# Altium schematic sheet [08] - IO-LINK.SchDoc
size A3; DocumentNumber: 9; SheetNumber: 9; SheetTotal: 12
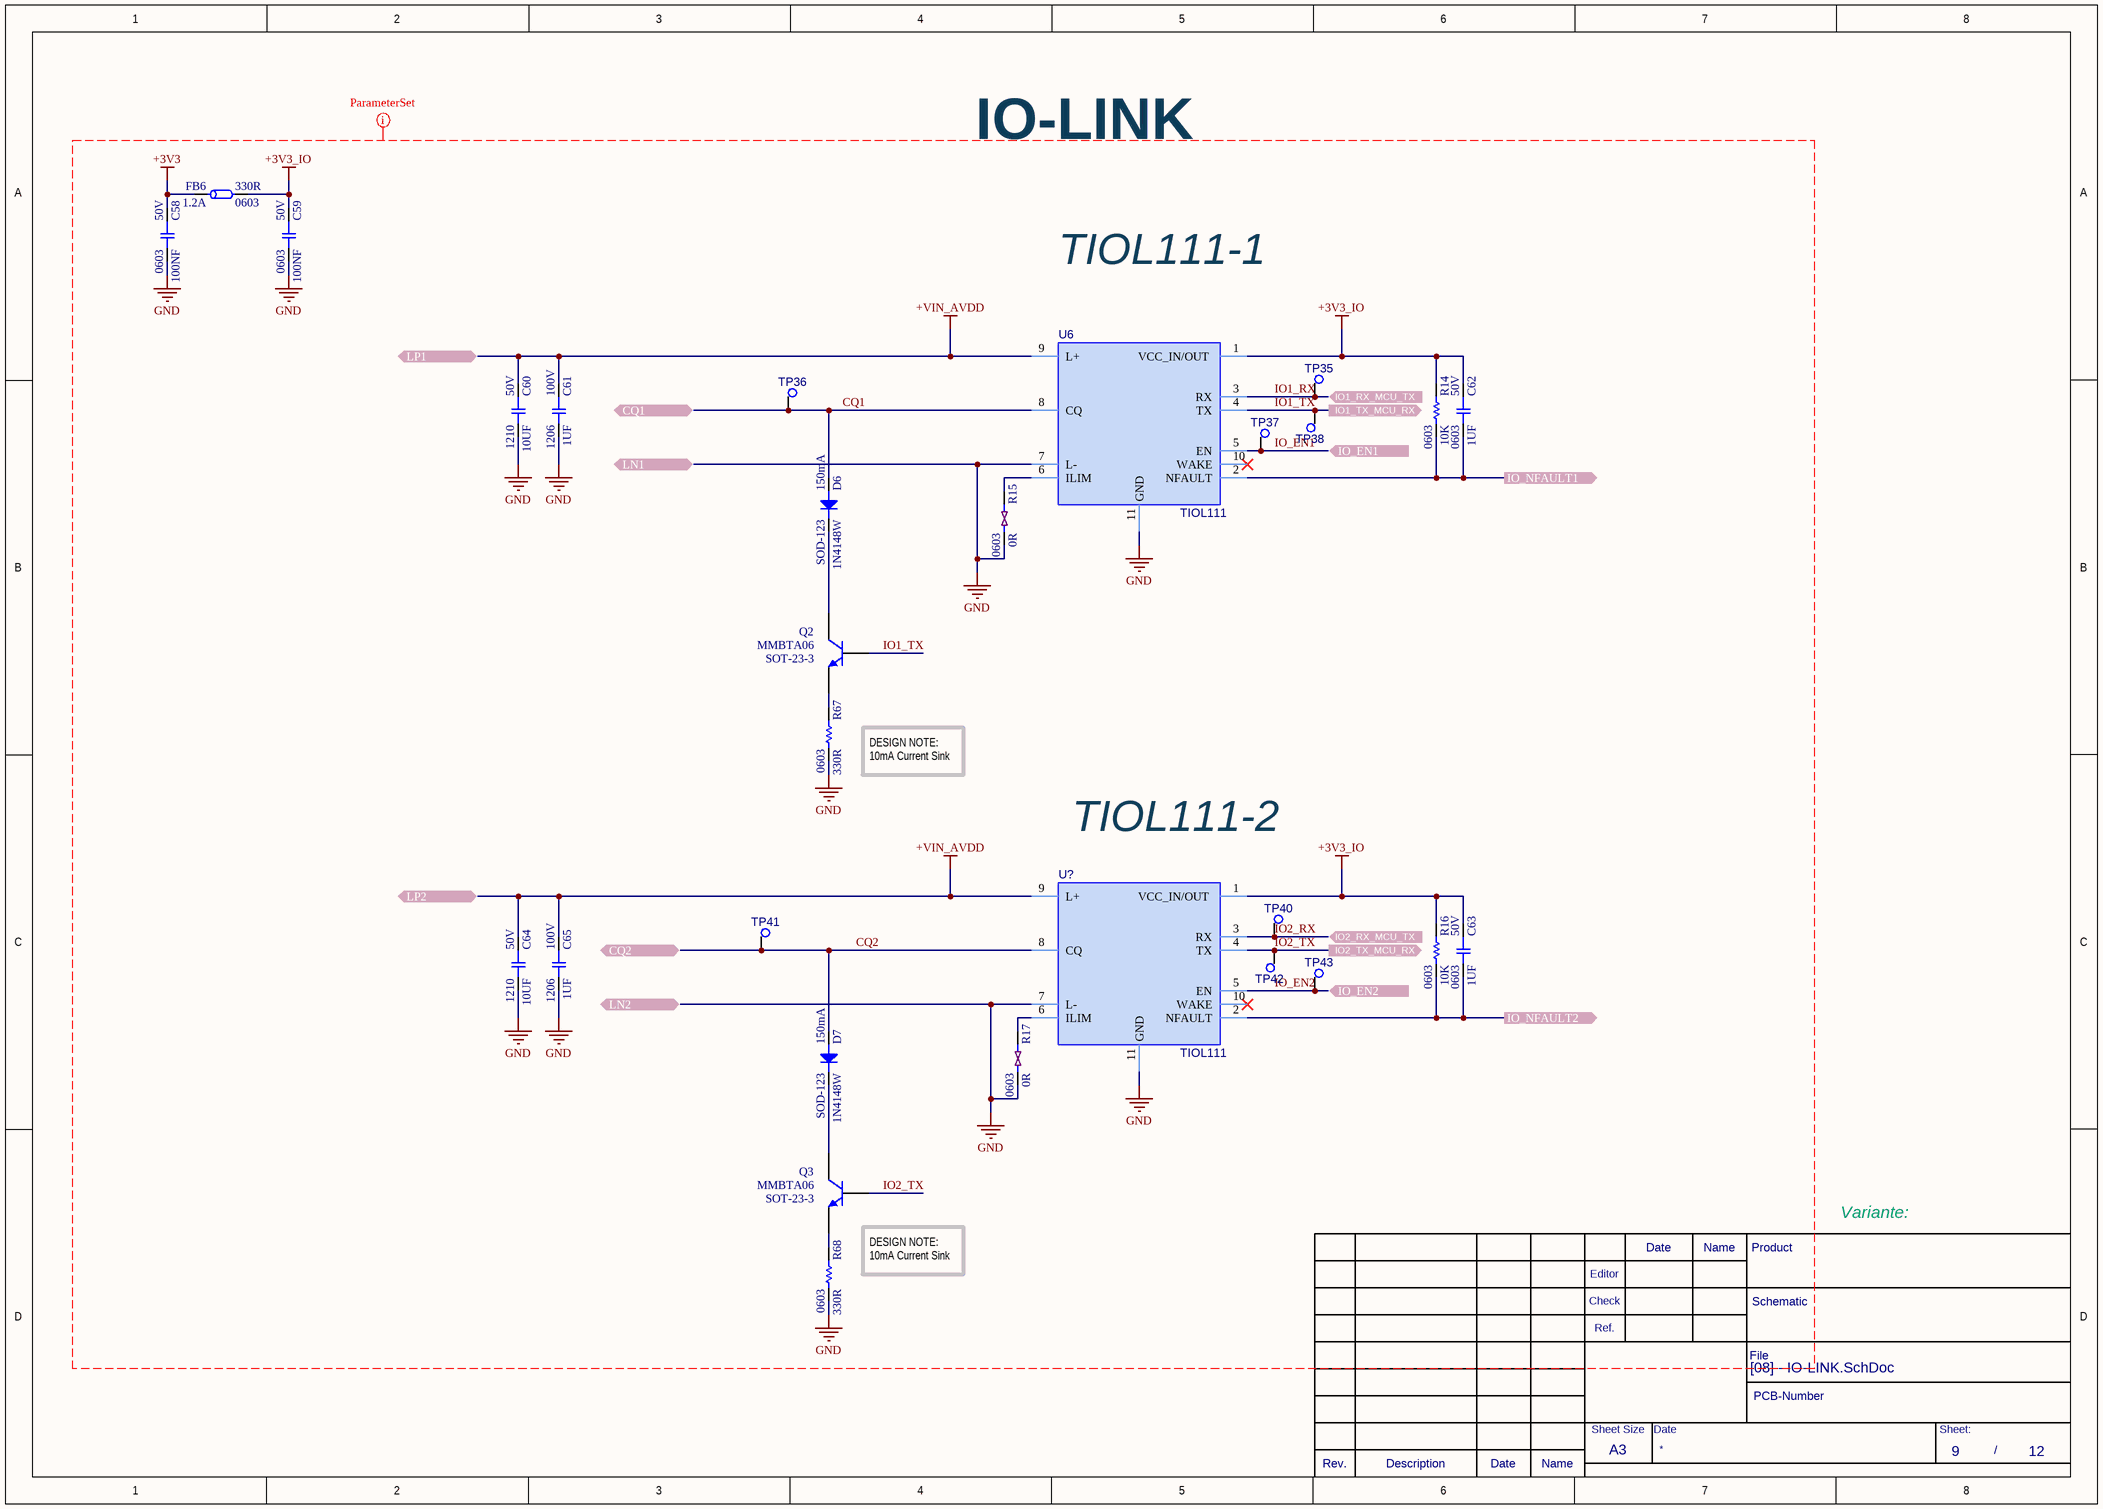
[diagram p0: [08] - IO-LINK.SchDoc]

## Parts
C58  100NF  Voltage Rating: 50V  Case Code (Imperial): 0603  [C-0603]
C59  100NF  Voltage Rating: 50V  Case Code (Imperial): 0603  [C-0603]
C60  10UF  Voltage Rating: 50V  Case/Package: 1210  [C-1210]
C61  1UF  Voltage Rating: 100V  Case Code (Imperial): 1206  [C-1206]
C62  1UF  Voltage Rating: 50V  Case Code (Imperial): 0603  [C-0603]
C63  1UF  Voltage Rating: 50V  Case Code (Imperial): 0603  [C-0603]
C64  10UF  Voltage Rating: 50V  Case/Package: 1210  [C-1210]
C65  1UF  Voltage Rating: 100V  Case Code (Imperial): 1206  [C-1206]
D6  1N4148W  Forward Current: 150mA  Package / Case: SOD-123  [D-SOD123]
D7  1N4148W  Forward Current: 150mA  Package / Case: SOD-123  [D-SOD123]
FB6  330R  Case/Package: 0603  DC Current: 1.2A  [FB-0603]
Q2  MMBTA06  Case/Package: SOT-23-3  [SOT23-3]
Q3  MMBTA06  Case/Package: SOT-23-3  [SOT23-3]
R14  10K  Case Code (Imperial): 0603  [R-0603]
R15  0R  Case Code (Imperial): 0603  [JMP-0603]
R16  10K  Case Code (Imperial): 0603  [R-0603]
R17  0R  Case Code (Imperial): 0603  [JMP-0603]
R67  330R  Case Code (Imperial): 0603  [R-0603]
R68  330R  Case Code (Imperial): 0603  [R-0603]
TP35  MECH-TESTPOINT  [MECH-TESTPOINT]  (value not drawn)  (no BOM)
TP36  MECH-TESTPOINT  [MECH-TESTPOINT]  (value not drawn)  (no BOM)
TP37  MECH-TESTPOINT  [MECH-TESTPOINT]  (value not drawn)  (no BOM)
TP38  MECH-TESTPOINT  [MECH-TESTPOINT]  (value not drawn)  (no BOM)
TP40  MECH-TESTPOINT  [MECH-TESTPOINT]  (value not drawn)  (no BOM)
TP41  MECH-TESTPOINT  [MECH-TESTPOINT]  (value not drawn)  (no BOM)
TP42  MECH-TESTPOINT  [MECH-TESTPOINT]  (value not drawn)  (no BOM)
TP43  MECH-TESTPOINT  [MECH-TESTPOINT]  (value not drawn)  (no BOM)
U6  TIOL111  [10-VSON EP]
U?  TIOL111  [10-VSON EP]

## Ports
CQ1 (bidir), CQ2 (bidir), IO1_RX_MCU_TX (in), IO1_TX_MCU_RX (out), IO2_RX_MCU_TX (in), IO2_TX_MCU_RX (out), IO_EN1 (in), IO_EN2 (in), IO_NFAULT1 (out), IO_NFAULT2 (out), LN1 (bidir), LN2 (bidir), LP1 (bidir), LP2 (bidir)

## Nets
+3V3: C58.1 FB6.1
+3V3_IO: C59.1 C62.1 C63.1 FB6.2 R14.1 R16.1 U6.1(VCC_IN/OUT) U?.1(VCC_IN/OUT)
+VIN_AVDD: C60.1 C61.1 C64.1 C65.1 U6.9(L+) U?.9(L+) ; port LP1, port LP2
GND: C58.2 C59.2 C60.2 C61.2 C64.2 C65.2 R15.2 R17.2 R67.2 R68.2 U6.7(L-) U6.11(GND) U?.7(L-) U?.11(GND) ; port LN1, port LN2
CQ1: D6.A TP36.1 U6.8(CQ) ; port CQ1
CQ2: D7.A TP41.1 U?.8(CQ) ; port CQ2
IO1_RX: TP35.1 U6.3(RX) ; port IO1_RX_MCU_TX
IO1_TX: Q2.1 TP38.1 U6.4(TX) ; port IO1_TX_MCU_RX
IO2_RX: TP40.1 U?.3(RX) ; port IO2_RX_MCU_TX
IO2_TX: Q3.1 TP42.1 U?.4(TX) ; port IO2_TX_MCU_RX
IO_EN1: TP37.1 U6.5(EN) ; port IO_EN1
IO_EN2: TP43.1 U?.5(EN) ; port IO_EN2
IO_NFAULT1: C62.2 R14.2 U6.2(NFAULT) ; port IO_NFAULT1
IO_NFAULT2: C63.2 R16.2 U?.2(NFAULT) ; port IO_NFAULT2
NetD6_C: D6.C Q2.3
NetD7_C: D7.C Q3.3
NetQ2_2: Q2.2 R67.1
NetQ3_2: Q3.2 R68.1
NetR15_1: R15.1 U6.6(ILIM)
NetR17_1: R17.1 U?.6(ILIM)

Not connected (* = marked no-connect by the designer): U6 10(WAKE)*; U? 10(WAKE)*

## Layout directives
net class IOLINK: +3V3, +3V3_IO, +VIN_AVDD, CQ1, CQ2, GND, IO1_RX, IO1_TX, IO2_RX, IO2_TX, IO_EN1, IO_EN2

## Notes on the sheet
- IO-LINK
- TIOL111-1
- (near R67) DESIGN NOTE:
  10mA Current Sink
- TIOL111-2
- DESIGN NOTE:
  10mA Current Sink
- Date
- Name
- Product
- Variante:
- Editor
- Check
- Ref.
- Schematic
- File
- PCB-Number
- Rev.
- Description
- Sheet Size
- A3
- Sheet:
- /

## Library data of the parts
C58 C59 = C-100NF-0603: CAP CER 0.1UF 50V X7R 0603; Manufacturer: TDK; Manufacturer Part Number: C1608X7R1H104K080AA; Tolerance: 10%; Dielectric Material: Ceramic; .PCBCHK: USED; .Creator: F:TALI; Washability: OK; Temperature Coefficient: 30ppm/°C; Mount: Surface Mount; Case/Package: 0603; Case Code (Metric): 1608; Min Operating Temperature: -55°C; Max Operating Temperature: 125°C; Package Quantity: 1; Packaging: Tape and Reel; Features: Soft Termination; Length: 1.6mm; Width: 0.8mm; Thickness: 0.037inch; Lead Free: Lead Free; Capacitance: 100nF; Supplier 1: Digi-Key; Supplier Part Number 1: 445-1314-1-ND; Stock 1: 0; Pricing 1: 1=0.1, 10=0.057, 100=0.0254, 500=0.01812, 1000=0.01423 (USD); Contact Plating: Matte,Tin; Voltage Rating (DC): 50V; Dielectric: X7R; Termination: SMD/SMT; Voltage: 50V; Height: 0.8mm; Depth: 0.8mm; REACH SVHC: No SVHC; ComponentLink1URL: http://www.mouser.com/ds/2/400/lcc_commercial_general_en-837201.pdf; ComponentLink1Description: http://www.mouser.com/ds/2/400/lcc_commercial_general_en-837201.pdf; ComponentLink2URL: https://product.tdk.com/info/en/catalog/spec/mlccspec_commercial_general_midvoltage_en.pdf; ComponentLink2Description: https://product.tdk.com/info/en/catalog/spec/mlccspec_commercial_general_midvoltage_en.pdf; Supplier 2: Digi-Key; Supplier Part Number 2: 478-3540-6-ND; Stock 2: 40000; Pricing 2: 1=0.23, 10=0.161, 100=0.0756, 500=0.05304, 1000=0.0439 (USD); Number of Pins: 2; Radiation Hardening: No; ComponentLink3URL: http://uk.rs-online.com/webdocs/13d1/0900766b813d1103.pdf; ComponentLink3Description: http://uk.rs-online.com/webdocs/13d1/0900766b813d1103.pdf; ComponentLink4URL: http://www.tdk.co.jp/tefe02/e412_c.pdf; ComponentLink4Description: http://www.tdk.co.jp/tefe02/e412_c.pdf; ComponentLink5URL: http://www.farnell.com/datasheets/2291921.pdf; ComponentLink5Description: http://www.farnell.com/datasheets/2291921.pdf; ComponentLink6URL: http://www.farnell.com/datasheets/1744655.pdf; ComponentLink6Description: http://www.farnell.com/datasheets/1744655.pdf; ComponentLink7URL: http://catalogs.avx.com/SurfaceMount.pdf; ComponentLink7Description: http://catalogs.avx.com/SurfaceMount.pdf; ComponentLink8URL: http://www.farnell.com/datasheets/630895.pdf; ComponentLink8Description: http://www.farnell.com/datasheets/630895.pdf; ComponentLink9URL: http://www.avx.com/docs/Catalogs/cx7r.pdf; ComponentLink9Description: http://www.avx.com/docs/Catalogs/cx7r.pdf; ComponentLink10URL: http://www.avx.com/docs/catalogs/cauto.pdf; ComponentLink10Description: http://www.avx.com/docs/catalogs/cauto.pdf; .SCHCHK: USED; Weight: 7.1E-05oz; Composition: Ceramic; ComponentLink11URL: https://www.verical.com/server-webapp/html/getDatasheet?partID=98691; ComponentLink11Description: https://www.verical.com/server-webapp/html/getDatasheet?partID=98691; ComponentLink12URL: https://www.avx.com/docs/Catalogs/flexiterm.pdf; ComponentLink12Description: https://www.avx.com/docs/Catalogs/flexiterm.pdf
C60 C64 = C-10UF-1210: CAP CER 10UF 50V X7R 1210; Manufacturer: Samsung; Manufacturer Part Number: CL32B106KBJNNNE; Material: Ceramic; Tolerance: 10%; .PCBCHK: USED; .Creator: M.OZKAN; Washability: OK; Supplier 1: Digi-Key; Supplier Part Number 1: 1276-3387-6-ND; Stock 1: 0; Pricing 1: 1=0.96, 10=0.704, 100=0.483, 500=0.38238 (USD); Mount: Surface Mount; Case Code (Metric): 3225; Case Code (Imperial): 1210; Min Operating Temperature: -55°C; Max Operating Temperature: 125°C; Packaging: Tape and Reel; Package Quantity: 1; Capacitance: 10uF; Dielectric: X7R; Voltage: 50V; Voltage Rating (DC): 50V; Length: 3.2mm; Height: 2.5mm; Width: 0.098inch; Thickness: 0.106inch; Depth: 2.5mm; Radiation Hardening: No; Lead Free: Lead Free; ComponentLink1URL: http://www.samsungsem.com/kr/support/product-search/mlcc/CL32B106KBJNNNE .jsp; ComponentLink1Description: http://www.samsungsem.com/kr/support/product-search/mlcc/CL32B106KBJNNNE .jsp; ComponentLink2URL: https://produktinfo.conrad.com/datenblaetter/450000-474999/450821-da-01-en-VS_KONDENSATOR_1210.pdf; ComponentLink2Description: https://produktinfo.conrad.com/datenblaetter/450000-474999/450821-da-01-en-VS_KONDENSATOR_1210.pdf; Supplier 2: Digi-Key; Supplier Part Number 2: 587-3167-6-ND; Stock 2: 0; Pricing 2: 1=1.02, 10=0.755, 100=0.5175 (USD); Termination: SMD/SMT; Halogen Free: Halogen Free; ComponentLink3URL: https://www.yuden.co.jp/productdata/catalog/mlcc_all_e.pdf; ComponentLink3Description: https://www.yuden.co.jp/productdata/catalog/mlcc_all_e.pdf; Supplier 3: Digi-Key; Supplier Part Number 3: 1276-3388-6-ND; Stock 3: 0; Pricing 3: 1=0.86, 10=0.61, 100=0.4017, 500=0.29756 (USD); ComponentLink4URL: http://www.samsungsem.com/kr/support/product-search/mlcc/CL32B106KBJNNWE.jsp; ComponentLink4Description: http://www.samsungsem.com/kr/support/product-search/mlcc/CL32B106KBJNNWE.jsp; .SCHCHK: USED
C61 C65 = C-1UF-1206: CAP CER 1UF 100V X7R 1206; Manufacturer: Samsung; Manufacturer Part Number: CL31B105KCHNNNE; Tolerance: 10%; .PCBCHK: CHECKED; .Creator: M.OZKAN; Washability: OK; Supplier 1: Digi-Key; Supplier Part Number 1: 1276-1838-6-ND; Stock 1: 0; Pricing 1: 1=0.36, 10=0.251, 100=0.1506, 500=0.11298, 1000=0.0954 (USD); Mount: Surface Mount; Case/Package: 1206; Case Code (Metric): 3216; Contact Plating: Tin; Min Operating Temperature: -55°C; Max Operating Temperature: 125°C; Packaging: Tape and Reel; Capacitance: 1uF; Dielectric: X7R; Length: 3.2mm; Height: 1.6mm; Width: 0.063inch; Thickness: 0.071inch; Depth: 1.6mm; Radiation Hardening: No; ComponentLink1URL: http://www.samsungsem.com/kr/support/product-search/mlcc/CL31B105KCHNNNE.jsp; ComponentLink1Description: http://www.samsungsem.com/kr/support/product-search/mlcc/CL31B105KCHNNNE.jsp; ComponentLink2URL: http://www1.futureelectronics.com/doc/SAMSUNG/CLSERIES.pdf; ComponentLink2Description: http://www1.futureelectronics.com/doc/SAMSUNG/CLSERIES.pdf; Supplier 2: Digi-Key; Supplier Part Number 2: 478-11459-6-ND; Stock 2: 142; Pricing 2: 1=1.2, 10=0.949, 100=0.7116, 500=0.53762, 1000=0.47438 (USD); Voltage Rating (DC): 100V; Package Quantity: 2000; Termination: SMD/SMT; ComponentLink3URL: http://www.mouser.com/ds/2/40/LD-Series-777051.pdf; ComponentLink3Description: http://www.mouser.com/ds/2/40/LD-Series-777051.pdf; Supplier 3: Digi-Key; Supplier Part Number 3: 445-4467-6-ND; Stock 3: 0; Pricing 3: 1=0.51, 10=0.36, 100=0.2368, 500=0.17538, 1000=0.14907 (USD); Weight: 0.000571oz; Composition: Ceramic; Voltage: 100V; REACH SVHC: No SVHC; Lead Free: Lead Free; ComponentLink4URL: http://www.mouser.com/ds/2/400/lcc_commercial_highvoltage_en-520036.pdf; ComponentLink4Description: http://www.mouser.com/ds/2/400/lcc_commercial_highvoltage_en-520036.pdf; ComponentLink5URL: http://uk.rs-online.com/webdocs/1532/0900766b81532cd0.pdf; ComponentLink5Description: http://uk.rs-online.com/webdocs/1532/0900766b81532cd0.pdf; ComponentLink6URL: http://www.farnell.com/datasheets/1484596.pdf; ComponentLink6Description: http://www.farnell.com/datasheets/1484596.pdf; ComponentLink7URL: http://product.tdk.com/en/catalog/datasheets/mlcc_commercial_midvoltage_en.pdf; ComponentLink7Description: http://product.tdk.com/en/catalog/datasheets/mlcc_commercial_midvoltage_en.pdf; .SCHCHK: CHECKED
C62 C63 = C-1UF-0603_1: CAP CER 1UF 50V X7R 0603; Manufacturer: Yageo; Manufacturer Part Number: CC0603KRX7R9BB105; Tolerance: 10%; .PCBCHK: USED; .Creator: M.OZKAN; Washability: OK; Supplier 1: Digi-Key; Supplier Part Number 1: 311-2082-1-ND; Stock 1: 0; Mount: Surface Mount; Case/Package: 0603; Weight: 7.1E-05oz; Case Code (Metric): 1608; Min Operating Temperature: -55°C; Max Operating Temperature: 125°C; Packaging: Tape and Reel; Package Quantity: 4000; Termination: SMD/SMT; Capacitance: 1uF; Voltage Rating (DC): 50V; Dielectric: X7R; Composition: Ceramic; Length: 0.063inch; Height: 0.8mm; Width: 0.031inch; Thickness: 0.035inch; Depth: 0.8mm; Radiation Hardening: No; Lead Free: Lead Free; ComponentLink1URL: https://www.yuden.co.jp/productdata/catalog/mlcc_all_e.pdf; ComponentLink1Description: https://www.yuden.co.jp/productdata/catalog/mlcc_all_e.pdf; ComponentLink2URL: http://datasheet.octopart.com/06035C105KAT2A-AVX-datasheet-13516023.pdf; ComponentLink2Description: http://datasheet.octopart.com/06035C105KAT2A-AVX-datasheet-13516023.pdf; .SCHCHK: USED; Halogen Free: Halogen Free; Supplier 2: Digi-Key; Supplier Part Number 2: 587-3247-6-ND; Stock 2: 0; Pricing 2: 1=0.29, 10=0.198, 100=0.1124, 500=0.07936, 1000=0.06943 (USD); Supplier 3: Digi-Key; Supplier Part Number 3: 478-10073-6-ND; Stock 3: 0; Pricing 3: 1=0.73, 10=0.519, 100=0.3416, 500=0.253, 1000=0.21505 (USD)
D6 D7 = D-1N4148W-SOD123: DIODE GEN PURP 100V 150MA SOD123; Manufacturer: MCC; Manufacturer Part Number: 1N4148W-TP; Max Surge Current: 2A; Forward Voltage: 1V; Recovery Time: 4ns; Max Reverse Leakage Current: 5uA; Power Dissipation: 400mW; Max Forward Surge Current (Ifsm): 1A; Element Configuration: Single; Polarity: Standard; Capacitance: 4pF; .PCBCHK: USED; .Creator: F:TALI; Washability: OK; Supplier 1: Digi-Key; Stock 1: 1558891; Pricing 1: 1=0.14, 10=0.131, 100=0.0856, 500=0.04186, 1000=0.02854 (USD); Mount: Surface Mount; Number of Pins: 2; Min Operating Temperature: -65°C; Max Operating Temperature: 150°C; Packaging: Tape and Reel; Package Quantity: 3000; Average Rectified Current: 150mA; Reverse Recovery Time: 4ns; Max Repetitive Reverse Voltage (Vrrm): 100V; Peak Non-Repetitive Surge Current: 2A; Voltage Rating (DC): 100V; Current Rating: 150mA; Output Current: 150mA; Max Reverse Voltage (DC): 100V; Length: 2.85mm; Height: 1.2mm; Width: 1.8mm; Radiation Hardening: No; REACH SVHC: Unknown; Lead Free: Lead Free; ComponentLink1URL: http://www.farnell.com/datasheets/1684829.pdf; ComponentLink1Description: http://www.farnell.com/datasheets/1684829.pdf; ComponentLink2URL: http://www.mccsemi.com/up_pdf/1N4148W(SOD123).pdf; ComponentLink2Description: http://www.mccsemi.com/up_pdf/1N4148W(SOD123).pdf; ComponentLink3URL: http://www.mouser.com/ds/2/258/1N4148W(SOD123)-349435.pdf; ComponentLink3Description: http://www.mouser.com/ds/2/258/1N4148W(SOD123)-349435.pdf; ComponentLink4URL: http://www.alliedelec.com/images/products/datasheets/bm/MCC/70055519.pdf; ComponentLink4Description: http://www.alliedelec.com/images/products/datasheets/bm/MCC/70055519.pdf; Supplier Part Number 1: 1N4148WTPMSDKR-ND; Parameter 2: *; .SCHCHK: USED
FB6 = FB-330R-0603: FERRITE BEAD 330 OHM 0603 1LN; Manufacturer: Murata; Manufacturer Part Number: BLM18PG331SN1D; Material: Steel,Ferrite; Tolerance: 25%; DC Resistance (DCR): 150mR; Number of Lines: 1; Test Frequency: 100MHz; Shielding: Unshielded; Washability: OK; .Creator: M.OZKAN; .PCBCHK: USED; Supplier 1: Digi-Key; RoHS: Yes; Number of Pins: 2; Core Material: Ferrite; Case Code (Metric): 1608; Case Code (Imperial): 0603; Min Operating Temperature: -55°C; Max Operating Temperature: 125°C; Impedance: 330R; Package Quantity: 1; Packaging: Tape and Reel; Current Rating: 1.2A; Max Current Rating: 1.2A; Termination: SMD/SMT; Number of Circuits: 1; Length: 1.75mm; Height: 0.8mm; Width: 0.8mm; Depth: 0.95mm; Radiation Hardening: No; REACH SVHC: No SVHC; Lead Free: Lead Free; ComponentLink1URL: https://datasheet.ciiva.com/6211/enfa0003-6211710.pdf?src-supplier=Digi-Key; ComponentLink1Description: https://datasheet.ciiva.com/6211/enfa0003-6211710.pdf?src-supplier=Digi-Key; Supplier Part Number 1: 490-5222-1-ND; Max DC Current: 1.2A; .SCHCHK: USED; Stock: 106218; Pricing: 1=0.1, 10=0.076, 25=0.0684, 50=0.05, 100=0.0433, 250=0.0342, 500=0.0288, 1000=0.0243 (USD)
Q2 Q3 = Q-MMBTA06: TRANS NPN 80V 0.5A SOT23; Manufacturer: ON Semiconductor; Manufacturer Part Number: MMBTA06LT1G; .Creator: F:TALI; .PCBCHK: USED; Max Power Dissipation: 225mW; Number of Elements: 1; Frequency: 100MHz; Emitter Base Voltage (VEBO): 4V; Collector Emitter Saturation Voltage: 250mV; Max Collector Current: 500mA; Power Dissipation: 300mW; Element Configuration: Single; hFE Min: 100; ComponentLink1URL: http://www.fairchildsemi.com/ds/MM/MMBTA06.pdf; ComponentLink1Description: http://www.fairchildsemi.com/ds/MM/MMBTA06.pdf; ComponentLink2URL: http://www.farnell.com/datasheets/48137.pdf; ComponentLink2Description: http://www.farnell.com/datasheets/48137.pdf; ComponentLink3URL: http://www.farnell.com/datasheets/1852077.pdf; ComponentLink3Description: http://www.farnell.com/datasheets/1852077.pdf; ComponentLink4URL: http://www.fairchildsemi.com/datasheets/MP/MPSA06.pdf; ComponentLink4Description: http://www.fairchildsemi.com/datasheets/MP/MPSA06.pdf; ComponentLink5URL: http://www.mouser.com/ds/2/149/MMBTA06-196120.pdf; ComponentLink5Description: http://www.mouser.com/ds/2/149/MMBTA06-196120.pdf; ComponentLink6URL: https://www.verical.com/server-webapp/html/getDatasheet?partID=130058; ComponentLink6Description: https://www.verical.com/server-webapp/html/getDatasheet?partID=130058; .SCHCHK: USED; Supplier 1: Digi-Key; Supplier Part Number 1: MMBTA06LT1GOSCT-ND; Stock: 165416; Pricing: 1=0.16, 10=0.15, 25=0.1424, 100=0.0627, 250=0.0602, 500=0.0492, 1000=0.0342 (USD); RoHS: Yes; Number of Pins: 3; Contact Plating: Tin,Matte; Min Operating Temperature: -55°C; Max Operating Temperature: 150°C; Package Quantity: 1; Collector Emitter Voltage (VCEO): 80V; Packaging: Tape and Reel; Polarity: NPN; Collector Base Voltage (VCBO): 80V; Collector Emitter Breakdown Voltage: 80V; Transition Frequency: 100MHz; Max Breakdown Voltage: 80V; Max Frequency: 100MHz; Gain Bandwidth Product: 100MHz; Voltage Rating (DC): 80V; Current Rating: 500mA; Length: 0.119inch; Height: 0.04inch; Width: 0.055inch; Radiation Hardening: No; REACH SVHC: No SVHC; Lead Free: Lead Free; ComponentLink7URL: https://datasheet.ciiva.com/4722/mmbta05lt1-d-101659-4722113.pdf?src-supplier=Mouser; ComponentLink7Description: https://datasheet.ciiva.com/4722/mmbta05lt1-d-101659-4722113.pdf?src-supplier=Mouser; ComponentLink8URL: https://datasheet.ciiva.com/15139/getdatasheetpartid-137838-15139444.pdf?src-supplier=Verical; ComponentLink8Description: https://datasheet.ciiva.com/15139/getdatasheetpartid-137838-15139444.pdf?src-supplier=Verical; ComponentLink9URL: https://datasheet.ciiva.com/16465/mmbta05lt1-d-16465685.pdf?src-supplier=Future+Electronics; ComponentLink9Description: https://datasheet.ciiva.com/16465/mmbta05lt1-d-16465685.pdf?src-supplier=Future+Electronics; ComponentLink10URL: https://datasheet.ciiva.com/11197/mmbta05lt1-d-11197414.pdf?src-supplier=Avnet; ComponentLink10Description: https://datasheet.ciiva.com/11197/mmbta05lt1-d-11197414.pdf?src-supplier=Avnet; ComponentLink11URL: https://datasheet.ciiva.com/11198/mmbta05lt1-d-11198678.pdf?src-supplier=Avnet; ComponentLink11Description: https://datasheet.ciiva.com/11198/mmbta05lt1-d-11198678.pdf?src-supplier=Avnet; ComponentLink12URL: https://datasheet.ciiva.com/976/mmbta05lt1-d-976473.pdf?src-supplier=Digi-Key; ComponentLink12Description: https://datasheet.ciiva.com/976/mmbta05lt1-d-976473.pdf?src-supplier=Digi-Key; ComponentLink13URL: https://datasheet.ciiva.com/976/mmbta05lt1-d-976474.pdf?src-supplier=Digi-Key; ComponentLink13Description: https://datasheet.ciiva.com/976/mmbta05lt1-d-976474.pdf?src-supplier=Digi-Key; ComponentLink14URL: https://datasheet.ciiva.com/976/mmbta05lt1-d-976475.pdf?src-supplier=Digi-Key; ComponentLink14Description: https://datasheet.ciiva.com/976/mmbta05lt1-d-976475.pdf?src-supplier=Digi-Key; ComponentLink15URL: https://datasheet.ciiva.com/7972/mmbta05lt1-d-7972078.pdf?src-supplier=Element14; ComponentLink15Description: https://datasheet.ciiva.com/7972/mmbta05lt1-d-7972078.pdf?src-supplier=Element14; ComponentLink16URL: https://datasheet.ciiva.com/16478/mmbta05lt1-d-16478574.pdf?src-supplier=Avnet+Asia; ComponentLink16Description: https://datasheet.ciiva.com/16478/mmbta05lt1-d-16478574.pdf?src-supplier=Avnet+Asia; ComponentLink17URL: https://datasheet.ciiva.com/25998/mmbta05lt1-d-25998830.pdf?src-supplier=Avnet+Europe; ComponentLink17Description: https://datasheet.ciiva.com/25998/mmbta05lt1-d-25998830.pdf?src-supplier=Avnet+Europe
R14 R16 = R-10K-0603: RES SMD 10K OHM 1% 1/10W 0603; Manufacturer: Yageo; Manufacturer Part Number: RC0603FR-0710KL; Resistance: 10kR; Temperature Coefficient: 100ppm/°C; Voltage Rating (DC): 50V; Power Rating: 100mW; Voltage Rating: 75V; .PCBCHK: USED; .Creator: F:TALI; Washability: OK; Supplier 1: Digi-Key; Supplier Part Number 1: 311-10.0KHRCT-ND; Stock 1: 37479107; Pricing 1: 1=0.1, 10=0.026, 100=0.0107, 1000=0.00478, 2500=0.00415 (USD); Case/Package: 0603; Number of Pins: 2; Weight: 7.1E-05oz; Case Code (Metric): 1608; Min Operating Temperature: -55°C; Max Operating Temperature: 155°C; Tolerance: 1%; Composition: Thick Film; Packaging: Tape and Reel; Military Standard: Not; Termination: SMD/SMT; Length: 1.6mm; Height: 0.45mm; Width: 0.8mm; Depth: 0.8mm; Lead Pitch: 0.3mm; REACH SVHC: No SVHC; Lead Free: Lead Free; ComponentLink1URL: http://www.farnell.com/datasheets/38590.pdf; ComponentLink1Description: http://www.farnell.com/datasheets/38590.pdf; ComponentLink2URL: https://www.verical.com/server-webapp/html/getDatasheet?partID=409289; ComponentLink2Description: https://www.verical.com/server-webapp/html/getDatasheet?partID=409289; ComponentLink3URL: http://www.farnell.com/datasheets/1868787.pdf; ComponentLink3Description: http://www.farnell.com/datasheets/1868787.pdf; ComponentLink4URL: http://www.farnell.com/datasheets/443971.pdf; ComponentLink4Description: http://www.farnell.com/datasheets/443971.pdf; ComponentLink5URL: http://www.farnell.com/datasheets/1738695.pdf; ComponentLink5Description: http://www.farnell.com/datasheets/1738695.pdf; Supplier 2: Digi-Key; Supplier Part Number 2: 311-10KGRDKR-ND; Stock 2: 34952003; Pricing 2: 1=0.1, 10=0.022, 100=0.0088, 1000=0.00396, 2500=0.00344 (USD); Contact Plating: Matte,Tin; Radiation Hardening: No; ComponentLink6URL: http://www.yageo.com/documents/recent/PYu-RC_Group_51_RoHS_L_9.pdf; ComponentLink6Description: http://www.yageo.com/documents/recent/PYu-RC_Group_51_RoHS_L_9.pdf; ComponentLink7URL: https://www.verical.com/server-webapp/html/getDatasheet?partID=327958; ComponentLink7Description: https://www.verical.com/server-webapp/html/getDatasheet?partID=327958; ComponentLink8URL: http://www.yageo.com/documents/recent/PYu-RC_Group_51_RoHS_L_2.pdf; ComponentLink8Description: http://www.yageo.com/documents/recent/PYu-RC_Group_51_RoHS_L_2.pdf; Mount: Surface Mount; Package Quantity: 1; Number of Terminations: 2; Max Power Dissipation: 100mW; Working Voltage: 75V; Features: Automotive AEC-Q200; ComponentLink9URL: http://www.farnell.com/datasheets/1678796.pdf; ComponentLink9Description: http://www.farnell.com/datasheets/1678796.pdf; ComponentLink10URL: http://industrial.panasonic.com/www-cgi/jvcr13pz.cgi?E+PZ+3+AOA0002+ERJ1GNJ120C+7+WW; ComponentLink10Description: http://industrial.panasonic.com/www-cgi/jvcr13pz.cgi?E+PZ+3+AOA0002+ERJ1GNJ120C+7+WW; ComponentLink11URL: http://industrial.panasonic.com/www-data/pdf/AOA0000/AOA0000CE1.pdf; ComponentLink11Description: http://industrial.panasonic.com/www-data/pdf/AOA0000/AOA0000CE1.pdf; ComponentLink12URL: http://www.jameco.com/Jameco/Products/ProdDS/2007265.pdf; ComponentLink12Description: http://www.jameco.com/Jameco/Products/ProdDS/2007265.pdf; ComponentLink13URL: https://industrial.panasonic.com/cdbs/www-data/pdf/RDA0000/AOA0000C301.pdf; ComponentLink13Description: https://industrial.panasonic.com/cdbs/www-data/pdf/RDA0000/AOA0000C301.pdf; Supplier 3: Digi-Key; Supplier Part Number 3: YAG1290DKR-ND; Stock 3: 0; Pricing 3: 1=0.1, 10=0.044, 100=0.0178, 1000=0.00798, 2500=0.00693 (USD); .SCHCHK: USED
R15 R17 = R-0R-0603: RES SMD 0 OHM 1/10W JUMP 0603; Manufacturer: Yageo; Manufacturer Part Number: RC0603JR-070RL; Resistance: 0mR; Tolerance: 1%; Power Rating: 100mW; Voltage Rating (DC): 50V; Temperature Coefficient: 200ppm/°C; Current Rating: 1A; Working Voltage: 75V; .PCBCHK: USED; .Creator: F:TALI; Washability: OK; Supplier 1: Digi-Key; Supplier Part Number 1: 311-0.0GRDKR-ND; Stock 1: 54397731; Pricing 1: 1=0.1, 10=0.021, 25=0.0152, 50=0.0114, 100=0.0084, 250=0.00644, 500=0.00514, 1000=0.00379 (USD); Case/Package: 0603; Number of Pins: 2; Contact Plating: Matte,Tin; Case Code (Metric): 1608; Min Operating Temperature: -55°C; Max Operating Temperature: 155°C; Composition: Thick Film; Packaging: Tape and Reel; Termination: SMD/SMT; Package Quantity: 5000; Voltage Rating: 50V; Military Standard: Not; Length: 1.6mm; Height: 0.45mm; Width: 0.8mm; Depth: 0.8mm; Radiation Hardening: No; REACH SVHC: No SVHC; Lead Free: Lead Free; ComponentLink1URL: http://www.farnell.com/datasheets/1738695.pdf; ComponentLink1Description: http://www.farnell.com/datasheets/1738695.pdf; ComponentLink2URL: https://www.verical.com/server-webapp/html/getDatasheet?partID=329462; ComponentLink2Description: https://www.verical.com/server-webapp/html/getDatasheet?partID=329462; ComponentLink3URL: http://www.yageo.com/documents/recent/PYu-RC_Group_51_RoHS_L_9.pdf; ComponentLink3Description: http://www.yageo.com/documents/recent/PYu-RC_Group_51_RoHS_L_9.pdf; ComponentLink4URL: http://www.farnell.com/datasheets/443971.pdf; ComponentLink4Description: http://www.farnell.com/datasheets/443971.pdf; ComponentLink5URL: http://documents.rs-components.com/techlib://itc_doclist_GB.htm?stockno=6515918; ComponentLink5Description: http://documents.rs-components.com/techlib://itc_doclist_GB.htm?stockno=6515918; Supplier 2: Digi-Key; Supplier Part Number 2: 311-0.0HRDKR-ND; Stock 2: 6104331; Pricing 2: 1=0.1, 10=0.021, 25=0.0152, 50=0.0114, 100=0.0084, 250=0.00644, 500=0.00514, 1000=0.00379 (USD); Number of Terminations: 2; Max Power Dissipation: 100mW; Features: Moisture Resistant; ComponentLink6URL: http://www.farnell.com/datasheets/1868787.pdf; ComponentLink6Description: http://www.farnell.com/datasheets/1868787.pdf; ComponentLink7URL: http://documents.rs-components.com/techlib://itc_doclist_GB.htm?stockno=5048827; ComponentLink7Description: http://documents.rs-components.com/techlib://itc_doclist_GB.htm?stockno=5048827; Supplier 3: Digi-Key; Supplier Part Number 3: P0.0GDKR-ND; Stock 3: 34178498; Pricing 3: 1=0.1, 10=0.042, 25=0.0304, 50=0.0232, 100=0.0171, 250=0.01308, 500=0.01046, 1000=0.0077 (USD); Mount: Surface Mount; ComponentLink8URL: http://industrial.panasonic.com/www-data/pdf/AOA0000/AOA0000CE1.pdf; ComponentLink8Description: http://industrial.panasonic.com/www-data/pdf/AOA0000/AOA0000CE1.pdf; ComponentLink9URL: http://www.farnell.com/datasheets/2059623.pdf; ComponentLink9Description: http://www.farnell.com/datasheets/2059623.pdf; ComponentLink10URL: http://www.jameco.com/Jameco/Products/ProdDS/1935748.pdf; ComponentLink10Description: http://www.jameco.com/Jameco/Products/ProdDS/1935748.pdf; ComponentLink11URL: http://www.farnell.com/datasheets/1678796.pdf; ComponentLink11Description: http://www.farnell.com/datasheets/1678796.pdf; ComponentLink12URL: http://www.alliedelec.com/m/d/51cd0790071e1666bdb9d00c57fcf960.pdf; ComponentLink12Description: http://www.alliedelec.com/m/d/51cd0790071e1666bdb9d00c57fcf960.pdf; .SCHCHK: USED
R67 R68 = R-330R-0603: RES SMD 330 OHM 5% 1/10W 0603; Manufacturer: Yageo; Manufacturer Part Number: RC0603JR-07330RL; Power Rating: 100mW; Voltage Rating (DC): 50V; Temperature Coefficient: 100ppm/°C; Working Voltage: 75V; .PCBCHK: USED; .Creator: F:TALI; Washability: OK; Stock 1: 0; Pricing 1: 1=0.1, 10=0.022, 100=0.0091, 1000=0.00429, 2500=0.00376 (USD); Case/Package: 0603; Number of Pins: 2; Case Code (Metric): 1608; Min Operating Temperature: -55°C; Max Operating Temperature: 155°C; Resistance: 330R; Tolerance: 5%; Packaging: Tape and Reel; Voltage Rating: 50V; Package Quantity: 5000; Termination: SMD/SMT; Composition: Thick Film; Military Standard: Not; Length: 1.6mm; Height: 0.45mm; Width: 0.8mm; Depth: 0.8mm; REACH SVHC: No SVHC; Lead Free: Lead Free; ComponentLink1URL: http://www.farnell.com/datasheets/1868787.pdf; ComponentLink1Description: http://www.farnell.com/datasheets/1868787.pdf; ComponentLink2URL: http://www.farnell.com/datasheets/443971.pdf; ComponentLink2Description: http://www.farnell.com/datasheets/443971.pdf; ComponentLink3URL: https://www.verical.com/server-webapp/html/getDatasheet?partID=342831; ComponentLink3Description: https://www.verical.com/server-webapp/html/getDatasheet?partID=342831; ComponentLink4URL: http://www.mouser.com/catalog/specsheets/RC0603.pdf; ComponentLink4Description: http://www.mouser.com/catalog/specsheets/RC0603.pdf; Stock 2: 185696; Pricing 2: 1=0.1, 10=0.016, 100=0.0064, 1000=0.00289, 2500=0.0025 (USD); Mount: Surface Mount; Contact Plating: Matte,Tin; Number of Terminations: 2; Max Power Dissipation: 100mW; Features: Automotive AEC-Q200; Radiation Hardening: No; Stock 3: 10218189; Pricing 3: 1=0.1, 10=0.026, 100=0.0107, 1000=0.00478, 2500=0.00415 (USD); ComponentLink5URL: http://www.yageo.com/documents/recent/PYu-RC_Group_51_RoHS_L_9.pdf; ComponentLink5Description: http://www.yageo.com/documents/recent/PYu-RC_Group_51_RoHS_L_9.pdf; ComponentLink6URL: http://www.farnell.com/datasheets/2167052.pdf; ComponentLink6Description: http://www.farnell.com/datasheets/2167052.pdf; ComponentLink7URL: http://www.farnell.com/datasheets/1686128.pdf; ComponentLink7Description: http://www.farnell.com/datasheets/1686128.pdf; ComponentLink8URL: http://documents.rs-components.com/techlib://itc_doclist_GB.htm?stockno=5046499; ComponentLink8Description: http://documents.rs-components.com/techlib://itc_doclist_GB.htm?stockno=5046499; .SCHCHK: USED; Supplier 1: Digi-Key; Supplier Part Number 1: 311-330GRCT-ND; Supplier 2: Digi-Key; Supplier Part Number 2: RMCF0603JT330RCT-ND
TP35-TP38 TP40-TP43 = MECH-TESTPOINT: .PCBCHK: USED; .Creator: F:TALI; Washability: OK; .SCHCHK: USED
U6 U? = IC-TIOL111DMWR: IC TRANSCEIVER 1/1 10VSON; Manufacturer: Texas Instruments; Receiver Hysteresis: 750mV; Data Rate: 250Kbps; Supplier 1: Digi-Key; Supplier Part Number 1: 296-49943-1-ND; Manufacturer Part Number: TIOL111DMWR; Stock: 596; Pricing: 1=3.47, 10=3.12, 25=2.9496, 100=2.4254, 250=2.1763, 500=2.0976 (USD); RoHS: No; Mount: Surface Mount; Min Operating Temperature: -40°C; Max Operating Temperature: 125°C; Packaging: Cut Tape; ComponentLink1URL: http://www.ti.com/lit/ds/symlink/tiol111.pdf?src-supplier=Digi-Key; ComponentLink1Description: http://www.ti.com/lit/ds/symlink/tiol111.pdf?src-supplier=Digi-Key